# Altium schematic sheet CW521_BallisticGel_CoverSheet.SchDoc: SRAM Target for EM Fault Testing
size Letter; Organization: NewAE Technology Inc.; Address1: 1083 Queen St., Suite 196; Address2: Halifax; Address3: NS; Address4: Canada B3H 0B2; SheetApproved: YES
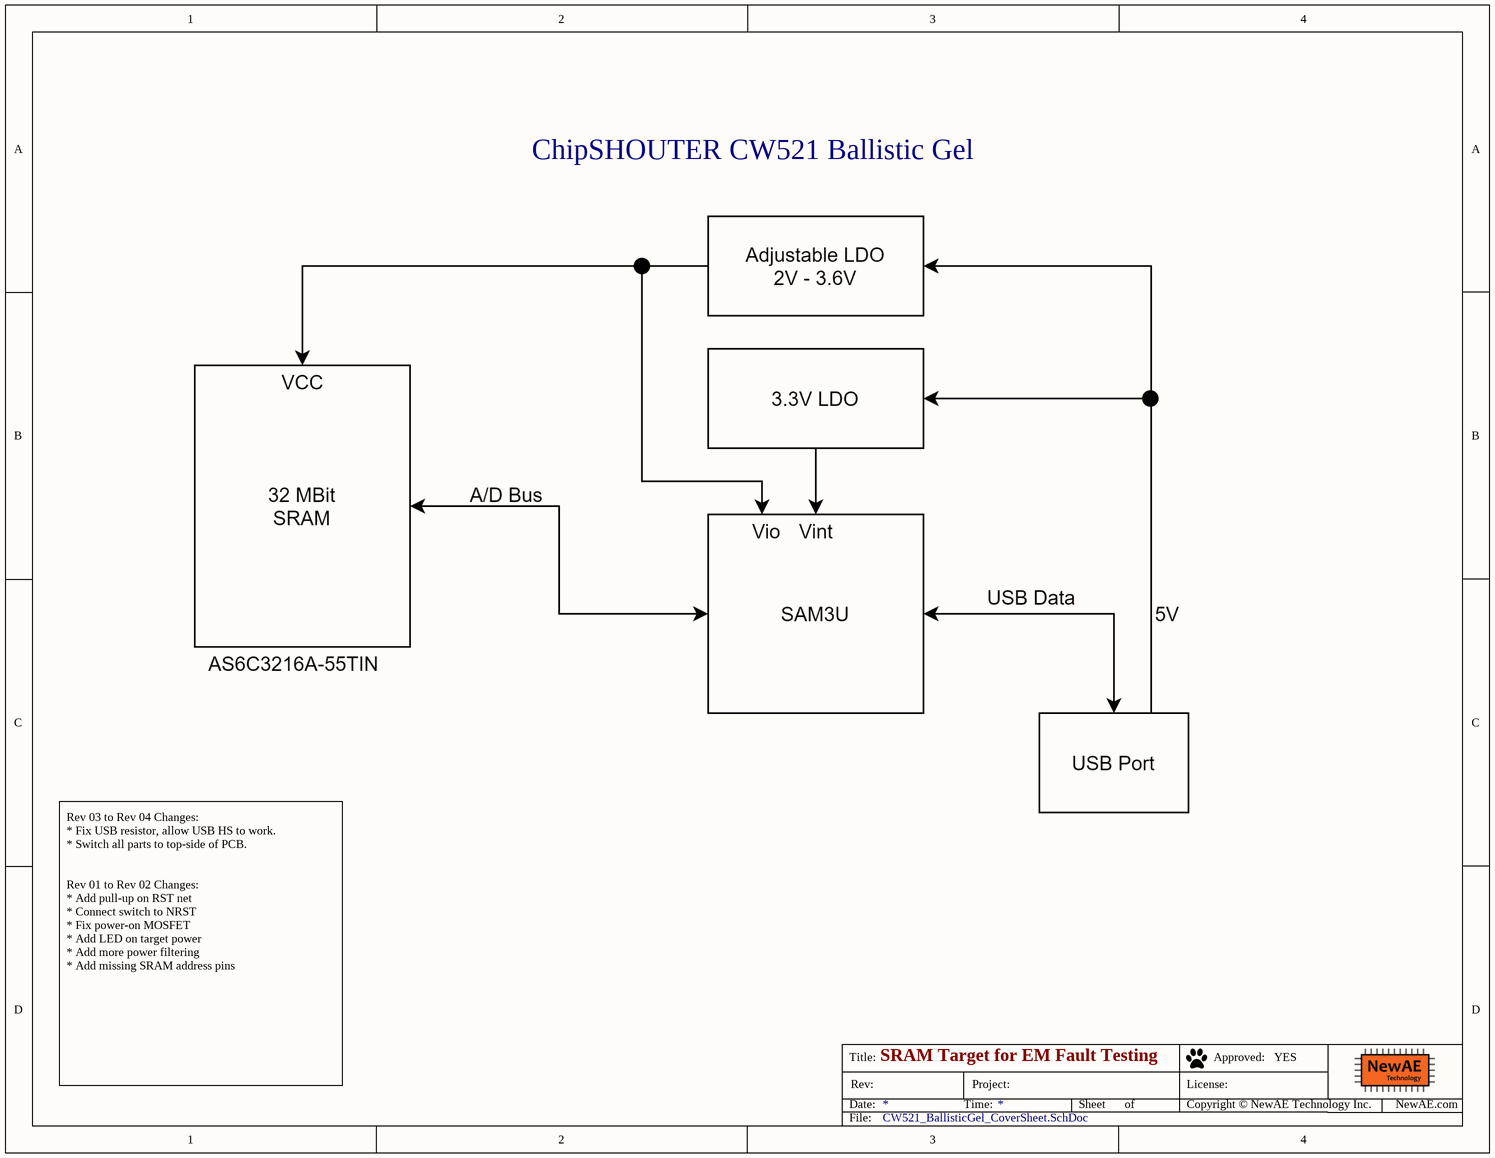
[diagram p0: CW521_BallisticGel_CoverSheet.SchDoc]

## Notes on the sheet
- ChipSHOUTER CW521 Ballistic Gel
- Rev 03 to Rev 04 Changes:
  * Fix USB resistor, allow USB HS to work.
  * Switch all parts to top-side of PCB.
  Rev 01 to Rev 02 Changes:
  * Add pull-up on RST net
  * Connect switch to NRST
  * Fix power-on MOSFET
  * Add LED on target power
  * Add more power filtering
  * Add missing SRAM address pins
- Title:
- Date:
- Rev:
- Time:
- Project:
- Sheet
- of
- License:
- Copyright © NewAE Technology Inc.
- Approved:
- NewAE.com
- File: